# Altium schematic sheet [03] - VOLTAGE REGULATION.SchDoc: VOLTAGE REGULATORS
size 433 x 279 mm; Author: ZAG; DrawnBy: ZAG; DocumentNumber: 5; SheetNumber: 3; SheetTotal: 8; PageSetup: Record=PageOptions|CenterHorizontal=True|CenterVertical=True|PrintScale=0.96|XCorrection=1.00|YCorrection=1.00|PrintKind=2|BorderSize=5000000|LeftOffset=0|BottomOffset=0|Orientation=2|PaperLength=4318|PaperWidth=2794|Scale=100|PaperSource=15|PrintQuality=600|MediaType=1|DitherType=10|PaperKind=11x17|PrintScaleMode=1; PCBRevision: 01; SchRevision: 01; Project: VAN BATT CTRLR V1; SchStatus: PRELIM
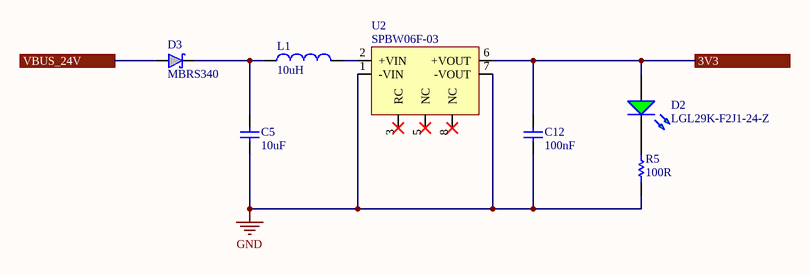
[diagram p0: [03] - VOLTAGE REGULATION.SchDoc]

## Parts
C5  10uF  [INCH 1206 - METRIC 3216 - H180]
C12  100nF  [INCH 0603 - METRIC 1608 - H090]
D2  LGL29K-F2J1-24-Z  [LED - 0603 - GREEN]
D3  MBRS340  [D0-214AB SMC - L]
L1  10uH  [VISHAY_IHLP2020BZER100M01]
R5  100R  [INCH 0603 - METRIC 1608 - H055]
U2  SPBW06F-03  [SPBW06F-03]

## Ports
3V3, VBUS_24V

## Nets
GND: C5.1 C12.1 R5.2 U2.1(-VIN) U2.7(-VOUT)
3V3: C12.2 D2.A U2.6(+VOUT) ; port 3V3
VBUS_24V: D3.2 ; port VBUS_24V
NetC5_2: C5.2 D3.1 L1.1
NetD2_C: D2.C R5.1
NetL1_2: L1.2 U2.2(+VIN)

Not connected (* = marked no-connect by the designer): U2 3(RC)* 5(NC)* 8(NC)*

## Notes on the sheet
- SHEET TITLE
- SCH REV:
- PROJECT NAME
- PCB REV:
- DATE:
- DRAWN BY
- CONTACT
- MANUFACTURER, OR SALE OF PROCESSES OR PRODUCTS WITHOUT THE EXPRESSED WRITTEN CONSENT OF
- THE INFORMATION CONTAINED HEREIN IS DEEMED TO BE CONFIDENTIAL, PROPRIETARY, AND A TRADE SECRET OF
- THIS INFORMATION MAY NOT BE USED, REPRODUCED, OR DISCLOSED AS THE DIRECT OR INDIRECT BASIS FOR THE DEVELOPMENT,
- SHEET
- www.mule-labs.com <http://www.mule-labs.com>
- OF
- SIZE: B
- DO NOT SCALE DRAWING

## Library data of the parts
C5 = C3216X5R1H106K160AB: CAP CER 10UF 50V X5R 1206; Manufacturer: TDK; Dielectric Material: Ceramic; Tolerance: 10%; Supplier 1: Digi-Key; Manufacturer Part Number: C3216X5R1H106K160AB; Stock 1: 20000; Pricing 1: 1=1.11, 10=0.841, 100=0.6016, 500=0.46576, 1000=0.40106 (USD); Mount: Surface Mount; Case/Package: 1206; Weight: 0.000571oz; Case Code (Metric): 3216; Case Code (Imperial): 1206; Min Operating Temperature: -55°C; Max Operating Temperature: 85°C; Capacitance: 10uF; Dielectric: X5R; Packaging: Tape and Reel; Voltage Rating: 50V; Voltage Rating (DC): 50V; Termination: SMD/SMT; Package Quantity: 1; Composition: Ceramic; Voltage: 50V; Length: 3.2mm; Height: 1.6mm; Width: 0.063inch; Depth: 1.6mm; Thickness: 0.071inch; Radiation Hardening: No; Lead Free: Lead Free; REACH SVHC: No SVHC; Supplier Part Number 1: 445-5998-6-ND
C12 = CGA3E2X7R1E104K080AA: CAP CER 0.1UF 25V X7R 0603; Manufacturer: TDK; Tolerance: 10%; Supplier 1: Digi-Key; Manufacturer Part Number: CGA3E2X7R1E104K080AA; Stock 1: 40000; Pricing 1: 1=0.1, 10=0.068, 100=0.0304, 500=0.02172, 1000=0.01706 (USD); Mount: Surface Mount; Case/Package: 0603; Weight: 7.1E-05oz; Case Code (Metric): 1608; Case Code (Imperial): 0603; Min Operating Temperature: -55°C; Max Operating Temperature: 125°C; Packaging: Tape and Reel; Capacitance: 100nF; Voltage Rating: 25V; Dielectric: X7R; Termination: SMD/SMT; Package Quantity: 1; Voltage Rating (DC): 25V; Composition: Ceramic; Length: 1.6mm; Height: 0.8mm; Depth: 0.8mm; Width: 0.031inch; Thickness: 0.035inch; Lead Free: Lead Free; REACH SVHC: No SVHC; ComponentLink1URL: https://datasheet.ciiva.com/22725/1735392-22725638.pdf; ComponentLink1Description: https://datasheet.ciiva.com/22725/1735392-22725638.pdf; ComponentLink2URL: https://datasheet.ciiva.com/24220/cga3e2x7r1e104k080aa-265934-24220022.pdf; ComponentLink2Description: https://datasheet.ciiva.com/24220/cga3e2x7r1e104k080aa-265934-24220022.pdf; ComponentLink3URL: https://datasheet.ciiva.com/22725/1735392-22725639.pdf; ComponentLink3Description: https://datasheet.ciiva.com/22725/1735392-22725639.pdf; ComponentLink4URL: https://datasheet.ciiva.com/16427/mlccspec-automotive-general-midvoltage-en-16427320.pdf; ComponentLink4Description: https://datasheet.ciiva.com/16427/mlccspec-automotive-general-midvoltage-en-16427320.pdf; ComponentLink5URL: https://datasheet.ciiva.com/23803/1735392-23803082.pdf; ComponentLink5Description: https://datasheet.ciiva.com/23803/1735392-23803082.pdf; Supplier Part Number 1: 445-5667-1-ND; Category: Capacitor
D2 = LGL29K-F2J1-24-Z: LED GREEN DIFFUSED 0603 SMD; Manufacturer: Osram Opto; Lens Color: White; Forward Current: 20mA; Forward Voltage: 1.7V; Luminous Intensity: 3.5mcd; Viewing Angle: 160°; Lens Style: Flat,Diffused,Colorless,Rectangular; Test Current: 2mA; Dominant Wavelength: 570nm; Luminous Flux: 0.015lm; Number of LEDs: 1; Lens Size: 0.8mm; Supplier 1: Digi-Key; Manufacturer Part Number: LGL29K-F2J1-24-Z; RoHS: Yes; Category: Uncategorized; Stock: 28779; Pricing: 1=0.410000, 10=0.287000, 100=0.167400, 500=0.114760, 1000=0.095640, 2500=0.086080 (USD); Mount: Surface Mount; Case/Package: 0603; Number of Pins: 2; Color: Green; Case Code (Metric): 1608; Case Code (Imperial): 0603; Min Operating Temperature: -40°C; Max Operating Temperature: 100°C; Illumination Color: Green; Packaging: Tape and Reel; Package Quantity: 5000; Lens Transparency: Diffused; Length: 1.7mm; Height: 0.65mm; Width: 0.8mm; Radiation Hardening: No; ComponentLink1URL: http://components.arrow.com/part/dataview/41971649S9781339N2128?src-supplier=Arrow; ComponentLink1Description: http://components.arrow.com/part/dataview/41971649S9781339N2128?src-supplier=Arrow; ComponentLink2URL: http://components.arrow.com/part/dataview/0323_02006818?src-supplier=Arrow+Europe; ComponentLink2Description: http://components.arrow.com/part/dataview/0323_02006818?src-supplier=Arrow+Europe; ComponentLink3URL: http://catalog.osram-os.com/catalogue/catalogue.do;jsessionid=3DE84243E85F820603DAFD5199D8DDA3?act=downloadFile&favOid=020000020000138e000100b6&src-supplier=Avnet; ComponentLink3Description: http://catalog.osram-os.com/catalogue/catalogue.do;jsessionid=3DE84243E85F820603DAFD5199D8DDA3?act=downloadFile&favOid=020000020000138e000100b6&src-supplier=Avnet; ComponentLink4URL: https://dammedia.osram.info/media/resource/hires/osram-dam-2493945/LG%20L29K.pdf?src-supplier=Digi-Key; ComponentLink4Description: https://dammedia.osram.info/media/resource/hires/osram-dam-2493945/LG%20L29K.pdf?src-supplier=Digi-Key; ComponentLink5URL: http://catalog.osram-os.com/catalogue/catalogue.do;jsessionid=3DE84243E85F820603DAFD5199D8DDA3?act=downloadFile&favOid=020000020000138e000100b6&src-supplier=Avnet+Europe; ComponentLink5Description: http://catalog.osram-os.com/catalogue/catalogue.do;jsessionid=3DE84243E85F820603DAFD5199D8DDA3?act=downloadFile&favOid=020000020000138e000100b6&src-supplier=Avnet+Europe; Supplier Part Number 1: 475-3118-1-ND
D3 = MBRS340: DIODE SCHOTTKY 40V 4A SMC; Manufacturer: ON Semiconductor / Fairchild; Element Configuration: Single; Max Surge Current: 80A; Max Reverse Leakage Current: 2mA; Polarity: Standard; Current Rating: 3A; Forward Voltage: 525mV; Supplier 1: Digi-Key; Manufacturer Part Number: MBRS340; Stock 1: 32395; Pricing 1: 1=0.65, 10=0.554, 100=0.4137, 500=0.32502, 1000=0.25115 (USD); Mount: Surface Mount; Number of Pins: 2; Weight: 0.3g; Contact Plating: Tin,Matte; Min Operating Temperature: -65°C; Max Operating Temperature: 125°C; Packaging: Tape and Reel; Average Rectified Current: 4A; Max Reverse Voltage (DC): 40V; Package Quantity: 1; Peak Non-Repetitive Surge Current: 80A; Voltage Rating (DC): 40V; Output Current: 3A; Peak Reverse Current: 2mA; Max Repetitive Reverse Voltage (Vrrm): 40V; Forward Current: 4A; Max Forward Surge Current (Ifsm): 80A; Length: 7.15mm; Height: 2.75mm; Width: 6.25mm; Radiation Hardening: No; Lead Free: Lead Free; REACH SVHC: No SVHC; ComponentLink1URL: https://datasheet.ciiva.com/22651/48013-22651968.pdf; ComponentLink1Description: https://datasheet.ciiva.com/22651/48013-22651968.pdf; ComponentLink2URL: https://datasheet.ciiva.com/4714/mbrs340-63506-4714275.pdf; ComponentLink2Description: https://datasheet.ciiva.com/4714/mbrs340-63506-4714275.pdf; ComponentLink3URL: https://datasheet.ciiva.com/8303/mbrs340-8303605.pdf; ComponentLink3Description: https://datasheet.ciiva.com/8303/mbrs340-8303605.pdf; ComponentLink4URL: https://datasheet.ciiva.com/8303/mbrs340-8303610.pdf; ComponentLink4Description: https://datasheet.ciiva.com/8303/mbrs340-8303610.pdf; ComponentLink5URL: https://datasheet.ciiva.com/30479/0900766b810e2514-30479354.pdf; ComponentLink5Description: https://datasheet.ciiva.com/30479/0900766b810e2514-30479354.pdf; ComponentLink6URL: https://datasheet.ciiva.com/911/mbrs340-911131.pdf; ComponentLink6Description: https://datasheet.ciiva.com/911/mbrs340-911131.pdf; ComponentLink7URL: https://datasheet.ciiva.com/911/mbrs340-911132.pdf; ComponentLink7Description: https://datasheet.ciiva.com/911/mbrs340-911132.pdf; ComponentLink8URL: https://datasheet.ciiva.com/911/mbrs340-911133.pdf; ComponentLink8Description: https://datasheet.ciiva.com/911/mbrs340-911133.pdf; ComponentLink9URL: https://datasheet.ciiva.com/15144/getdatasheetpartid-102412-15144829.pdf; ComponentLink9Description: https://datasheet.ciiva.com/15144/getdatasheetpartid-102412-15144829.pdf; ComponentLink10URL: https://datasheet.ciiva.com/25951/mbrs340-25951711.pdf; ComponentLink10Description: https://datasheet.ciiva.com/25951/mbrs340-25951711.pdf; ComponentLink11URL: https://datasheet.ciiva.com/26788/mbrs340-26788710.pdf; ComponentLink11Description: https://datasheet.ciiva.com/26788/mbrs340-26788710.pdf; Supplier Part Number 1: MBRS340FSCT-ND; Category: Diode
L1 = IHLP2020BZER100M01: FIXED IND 10UH 2.3A 199 MOHM SMD; Manufacturer: Vishay Dale; Core Material: Ferrite,Metal,Composite; DC Resistance (DCR): 199mR; Tolerance: 20%; Test Frequency: 100kHz; Saturation Current: 4A; Shielding: Shielded; Self Resonant Frequency: 20MHz; Supplier 1: Digi-Key; Manufacturer Part Number: IHLP2020BZER100M01; RoHS: Yes; Category: Ferrite Beads and Chips; Stock: 59711; Pricing: 1=1.17000, 10=1.08900, 25=1.00560, 50=0.83800, 100=0.78760, 250=0.70384, 500=0.60328, 1000=0.53626 (USD); Mount: Surface Mount; Case/Package: 2020; Number of Pins: 2020; Min Operating Temperature: -55°C; Max Operating Temperature: 125°C; Inductance: 10uH; Max DC Current: 2.3A; Termination: SMD/SMT; Military Standard: Not; RMS Current (Irms): 2.3A; Package Quantity: 2000; Current Rating: 2.3A; Packaging: Tape and Reel; Inductance Tolerance: 20%; Length: 5.49mm; Height: 2mm; Depth: 5.43mm; Height - Seated (Max): 0.079inch; Width: 0.204inch; Radiation Hardening: No; REACH SVHC: Unknown; Lead Free: Lead Free; ComponentLink1URL: https://datasheet.ciiva.com/16389/lp20bz01-16389281.pdf?src-supplier=Future+Electronics; ComponentLink1Description: https://datasheet.ciiva.com/16389/lp20bz01-16389281.pdf?src-supplier=Future+Electronics; ComponentLink2URL: https://datasheet.ciiva.com/3081/lp20bz01-3081940.pdf?src-supplier=Avnet; ComponentLink2Description: https://datasheet.ciiva.com/3081/lp20bz01-3081940.pdf?src-supplier=Avnet; ComponentLink3URL: https://datasheet.ciiva.com/5706/482851-5706582.pdf?src-supplier=Farnell; ComponentLink3Description: https://datasheet.ciiva.com/5706/482851-5706582.pdf?src-supplier=Farnell; ComponentLink4URL: https://datasheet.ciiva.com/8017/482851-8017225.pdf?src-supplier=Element14; ComponentLink4Description: https://datasheet.ciiva.com/8017/482851-8017225.pdf?src-supplier=Element14; ComponentLink5URL: https://datasheet.ciiva.com/17269/lp20bz01-17269485.pdf?src-supplier=Avnet+Europe; ComponentLink5Description: https://datasheet.ciiva.com/17269/lp20bz01-17269485.pdf?src-supplier=Avnet+Europe; ComponentLink6URL: https://datasheet.ciiva.com/3081/lp20bz01-3081941.pdf?src-supplier=Avnet; ComponentLink6Description: https://datasheet.ciiva.com/3081/lp20bz01-3081941.pdf?src-supplier=Avnet; ComponentLink7URL: https://datasheet.ciiva.com/5706/482851-5706581.pdf?src-supplier=Farnell; ComponentLink7Description: https://datasheet.ciiva.com/5706/482851-5706581.pdf?src-supplier=Farnell; Supplier Part Number 1: 541-1093-1-ND
R5 = CPF0603B100RE1: RES SMD 100 OHM 0.1% 1/16W 0603; Manufacturer: TE Connectivity Neohm; Temperature Coefficient: 25ppm/°C; Power Rating: 63mW; Voltage Rating: 50V; Number of Resistors: 1; Supplier 1: Digi-Key; Manufacturer Part Number: CPF0603B100RE1; RoHS: Yes; Category: Chip SMD Resistors; Stock: 7060; Pricing: 1=0.65000, 10=0.46300, 100=0.24080 (USD); Mount: Surface Mount; Case/Package: 0603; Number of Pins: 2; Weight: 7.1E-05oz; Case Code (Imperial): 0603; Case Code (Metric): 1608; Min Operating Temperature: -55°C; Max Operating Temperature: 155°C; Resistance: 100R; Tolerance: 0.1%; Packaging: Tape and Reel; Package Quantity: 1000; Composition: Thin Film; Number of Terminations: 2; Termination: Solder; Voltage Rating (DC): 50V; Length: 1.55mm; Height: 0.45mm; Width: 0.8mm; REACH SVHC: No SVHC; ELV: Compliant; ComponentLink1URL: https://datasheet.ciiva.com/6767/1652074-6767153.pdf?src-supplier=Newark; ComponentLink1Description: https://datasheet.ciiva.com/6767/1652074-6767153.pdf?src-supplier=Newark; ComponentLink2URL: https://datasheet.ciiva.com/6116/eng-ds-1773200-j-6116235.pdf?src-supplier=Farnell; ComponentLink2Description: https://datasheet.ciiva.com/6116/eng-ds-1773200-j-6116235.pdf?src-supplier=Farnell; ComponentLink3URL: https://datasheet.ciiva.com/12834/eng-ds-1773200-i-12834812.pdf?src-supplier=Mouser; ComponentLink3Description: https://datasheet.ciiva.com/12834/eng-ds-1773200-i-12834812.pdf?src-supplier=Mouser; Supplier Part Number 1: A102330CT-ND
U2 = SPBW06F-03: DC DC CONVERTER 3.3V 5W; Manufacturer: Mean Well; Supplier 1: Digi-Key; RoHS: No; Category: Board Mount Modules; ComponentLink1URL: https://media.digikey.com/pdf/Data%20Sheets/Mean%20Well%20PDF's/SPBW06,DPBW06_Ds.pdf?src-supplier=Digi-Key; ComponentLink1Description: https://media.digikey.com/pdf/Data%20Sheets/Mean%20Well%20PDF's/SPBW06,DPBW06_Ds.pdf?src-supplier=Digi-Key; Supplier Part Number 1: 1866-4809-ND; Manufacturer Part Number: SPBW06F-03; Stock: 1973; Pricing: 1=9.99000, 10=9.83900, 25=9.68760, 50=9.38480, 100=8.47660, 250=8.32524, 500=8.17388 (USD)